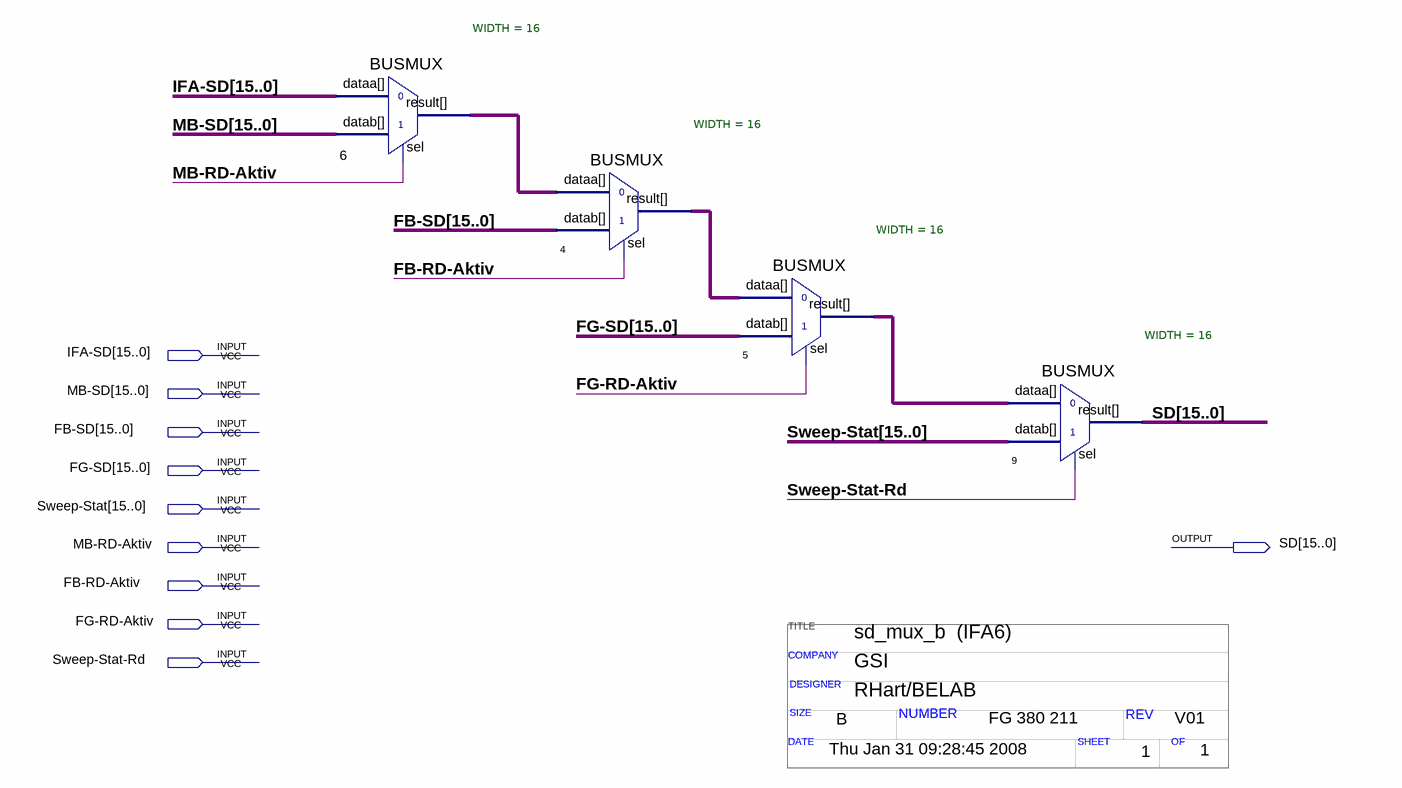
[diagram p0: schematic sheet]
// Quartus schematic sd_mux_b.bdf as structural Verilog: 4 symbols, 10 pins
// Title block: TITLE: sd_mux_b  (IFA6); COMPANY: GSI; DESIGNER: RHart/BELAB; SIZE: B; NUMBER: FG 380 211; REV: V01; DATE: Thu Jan 31 09:28:45 2008; SHEET: 1; OF: 1
module sd_mux_b (
  input  [15:0] \IFA-SD ,
  input  [15:0] \MB-SD ,
  input  [15:0] \FB-SD ,
  input  [15:0] \FG-SD ,
  input  [15:0] \Sweep-Stat ,
  input  \MB-RD-Aktiv ,
  input  \FB-RD-Aktiv ,
  input  \FG-RD-Aktiv ,
  input  \Sweep-Stat-Rd ,
  output [15:0] SD
);

  wire [15:0] n4_result, n5_result, n6_result;

  BUSMUX #(.WIDTH(16)) u_6 (.datab(\MB-SD ), .sel(\MB-RD-Aktiv ), .dataa(\IFA-SD ), .result(n6_result));
  BUSMUX #(.WIDTH(16)) u_4 (.datab(\FB-SD ), .sel(\FB-RD-Aktiv ), .dataa(n6_result), .result(n4_result));
  BUSMUX #(.WIDTH(16)) u_5 (.datab(\FG-SD ), .sel(\FG-RD-Aktiv ), .dataa(n4_result), .result(n5_result));
  BUSMUX #(.WIDTH(16)) u_9 (.datab(\Sweep-Stat ), .sel(\Sweep-Stat-Rd ), .dataa(n5_result), .result(SD));
endmodule
